# EAGLE design MCP9808  (EAGLE 9.6.2)
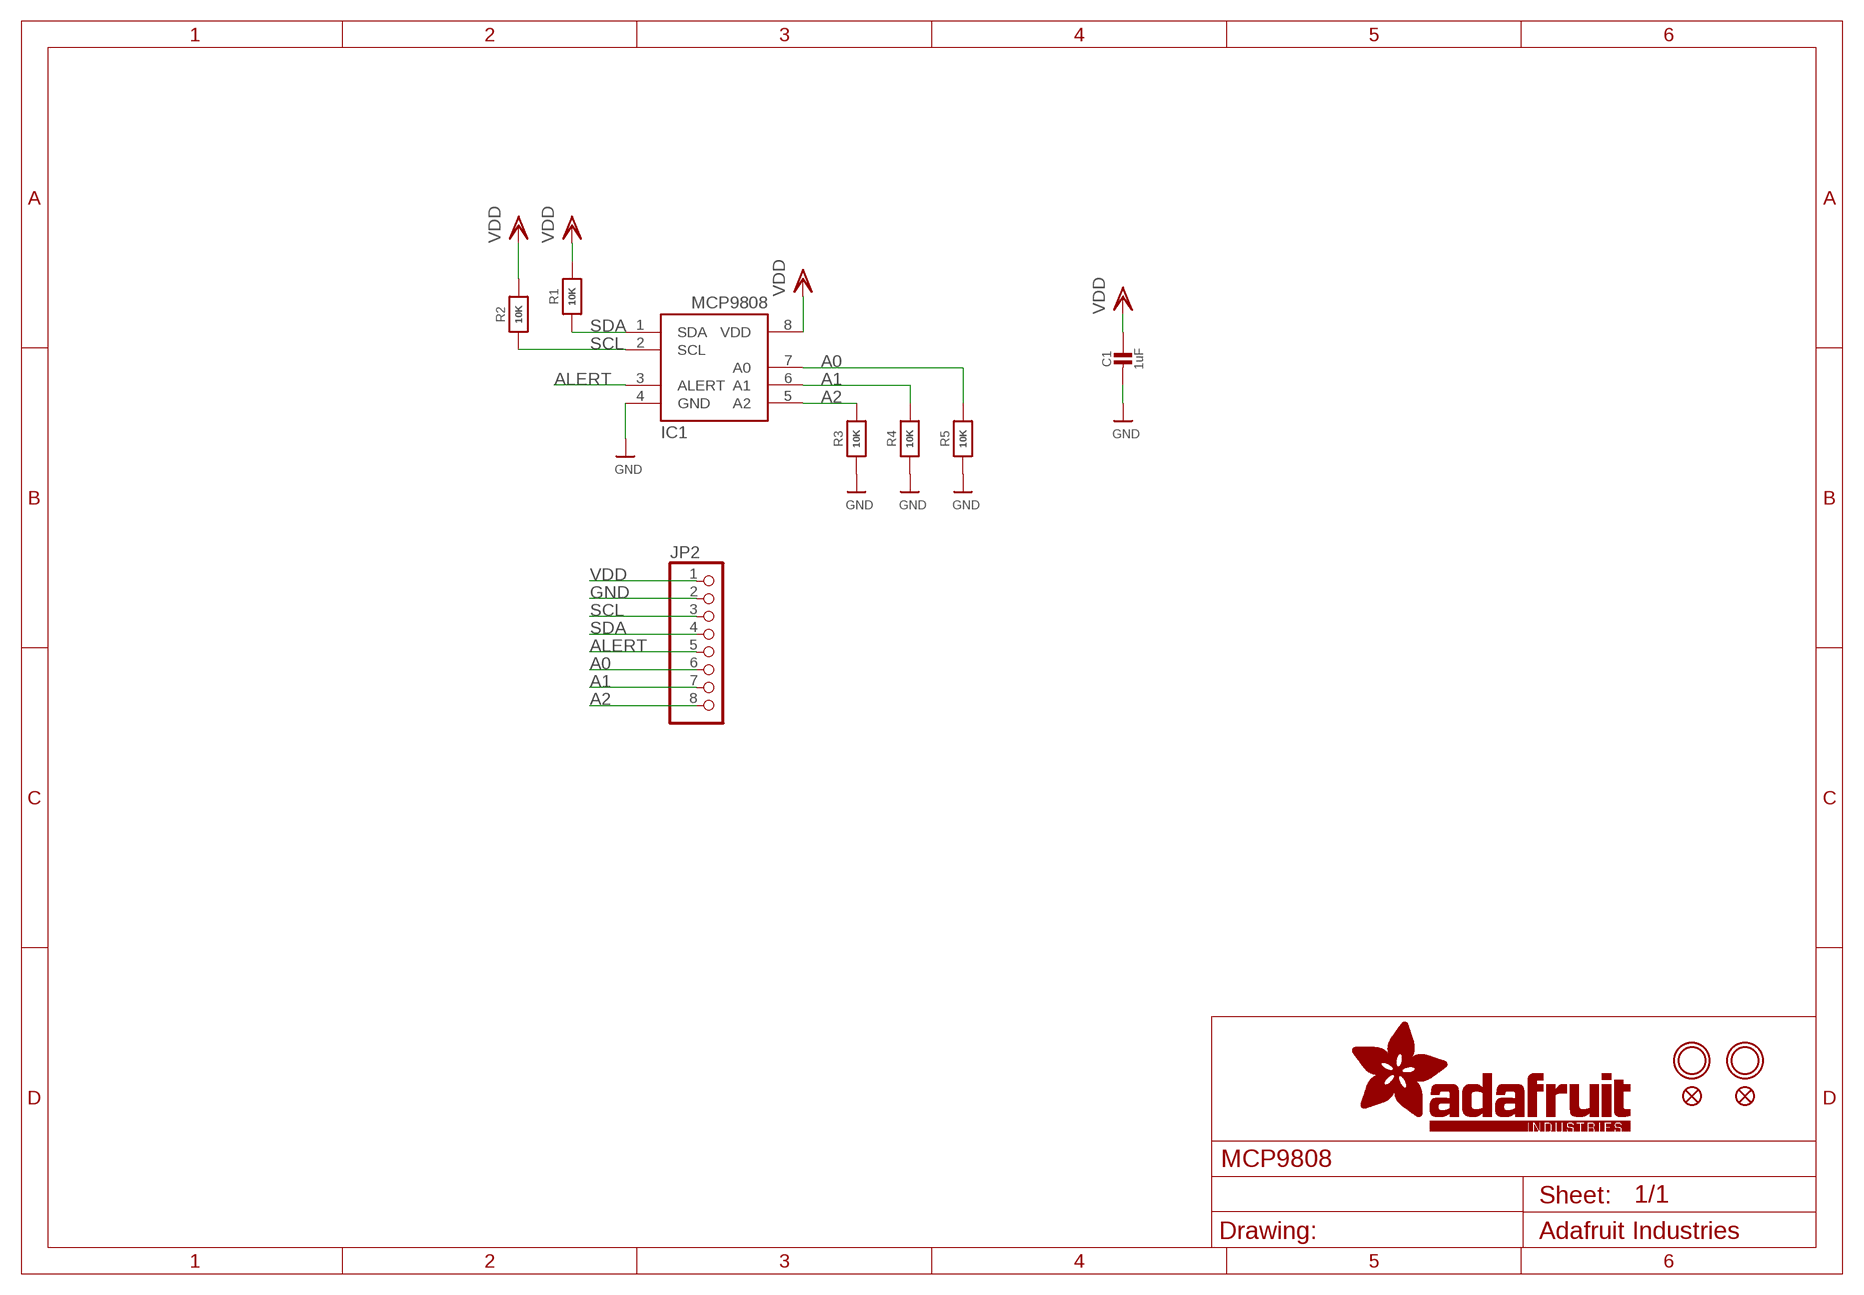
[diagram p0: schematic, sheet 1]

## Parts
C1  1uF  CAP_CERAMIC_0805MP  [_0805MP]
FID1  FIDUCIAL""  [FIDUCIAL_1MM]
FID2  FIDUCIAL""  [FIDUCIAL_1MM]
IC1  MCP9808-E/MS  [MSOP8_0.65MM]
JP2  HEADER-1X870MIL  [1X08_ROUND_70]
R1  10K  RESISTOR0805_NOOUTLINE  [0805-NO]
R2  10K  RESISTOR0805_NOOUTLINE  [0805-NO]
R3  10K  RESISTOR0805_NOOUTLINE  [0805-NO]
R4  10K  RESISTOR0805_NOOUTLINE  [0805-NO]
R5  10K  RESISTOR0805_NOOUTLINE  [0805-NO]
U$3  MOUNTINGHOLE2.5  [MOUNTINGHOLE_2.5_PLATED]
U$5  MOUNTINGHOLE2.5  [MOUNTINGHOLE_2.5_PLATED]

## Nets
A0: IC1.7(A0) JP2.6 R5.2
A1: IC1.6(A1) JP2.7 R4.2
A2: IC1.5(A2) JP2.8 R3.2
ALERT: IC1.3(ALERT) JP2.5
GND: C1.2 IC1.4(GND) JP2.2 R3.1 R4.1 R5.1
SCL: IC1.2(SCL) JP2.3 R2.1
SDA: IC1.1(SDA) JP2.4 R1.1
VDD: C1.1 IC1.8(VDD) JP2.1 R1.2 R2.2

## Library data of the parts
C1 = microbuilder:CAP_CERAMIC: Ceramic Capacitors For new designs, use the packages preceded by an '_' character since they are more reliable: The following footprints should be used on most boards: _0402 - Standard footprint for regular board layouts _0603 - Standard footprint for regular board layouts _0805 - Standard footprint for regular board layouts _1206 - Standard footprint for regular board layouts For extremely tight-pitch boards where space is at a premium, the following 'micro-pitch' footprints can be used (smaller pads, no silkscreen outline, etc.): _0402MP - Micro-pitch footprint for very dense/compact boards _0603MP - Micro-pitch footprint for very dense/compact boards _0805MP - Micro-pitch footprint for very dense/compact boards _1206MP - Micro-pitch footprint for very dense/compact boards
FID1 FID2 = microbuilder:FIDUCIAL: Fiducial Alignment Points Various fiducial points for machine vision alignment.; BOM: EXCLUDE
IC1 = microbuilder:MCP9808
JP2 = microbuilder:HEADER-1X8: PIN HEADER
R1-R5 = microbuilder:RESISTOR: Resistors For new designs, use the packages preceded by an '_' character since they are more reliable: The following footprints should be used on most boards: _0402 - Standard footprint for regular board layouts _0603 - Standard footprint for regular board layouts _0805 - Standard footprint for regular board layouts _1206 - Standard footprint for regular board layouts For extremely tight-pitch boards where space is at a premium, the following 'micro-pitch' footprints can be used (smaller pads, no silkscreen outline, etc.): _0402MP - Micro-pitch footprint for very dense/compact boards _0603MP - Micro-pitch footprint for very dense/compact boards _0805MP - Micro-pitch footprint for very dense/compact boards _1206MP - Micro-pitch footprint for very dense/compact boards
U$3 U$5 = microbuilder:MOUNTINGHOLE: Mounting Hole For #2 screws (0.086"/2.18mm width, 0.094"/2.4mm hole) use 2.5mm; BOM: EXCLUDE

## Board
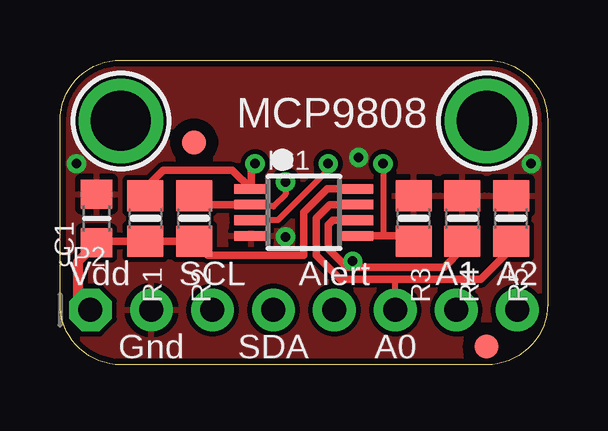
[diagram p1: board, top side]
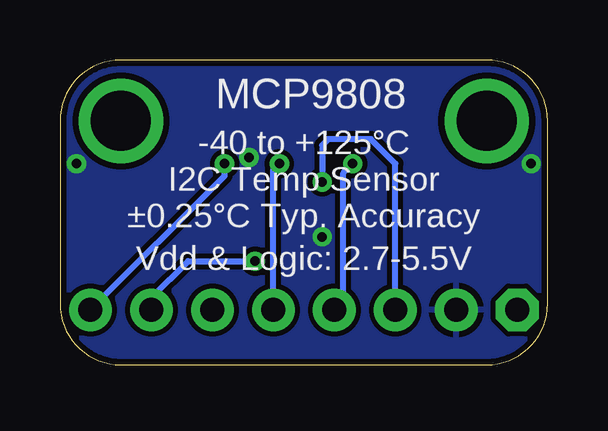
[diagram p2: board, bottom side, seen from below]

Size 20.32 x 12.7 mm. Coordinates in mm from the lower left corner, seen from the top.
Outline: 20.32,10.16 20.32,2.54 arc-90 17.78,0 2.54,0 arc-90 0,2.54 0,10.16 arc-90 2.54,12.7 17.78,12.7 arc-90 20.32,10.16
Copper layers (1*16): Top 0.035mm / dielectric 1.5mm / Bottom 0.035mm
Design rules "adafruit": minimum track width 8mil, minimum drill 15.5mil, track to track 8mil, track to pad 8mil, pad to pad 8mil, via to via 8mil, smd to smd 8mil, copper to edge 10mil, drill to drill 8mil, minimum pad ring 10mil, minimum via ring 8mil, stop-mask expansion 2mil, vias tented up to drill 20mil, thermal gap 10mil

### Footprints (pad centres in the part's own frame; a part is rotated, then mirrored left to right if it is on the bottom)
_0805MP = smd 1.2 x 1.3: 1 -1.016,0; 2 1.016,0
FIDUCIAL_1MM = smd 1 x 1: 1 0,0
MSOP8_0.65MM = smd 0.4 x 1.4: 1 -0.975,-2.2; 2 -0.325,-2.2; 3 0.325,-2.2; 4 0.975,-2.2; 5 0.975,2.2; 6 0.325,2.2; 7 -0.325,2.2; 8 -0.975,2.2
1X08_ROUND_70 = drill 1 pad 1.778 octagon: 1 -8.89,0 | drill 1 pad 1.778: 2 -6.35,0; 3 -3.81,0; 4 -1.27,0; 5 1.27,0; 6 3.81,0; 7 6.35,0; 8 8.89,0
0805-NO = smd 1.3 x 1.5: 1 -0.95,0; 2 0.95,0
MOUNTINGHOLE_2.5_PLATED = drill 2.5 pad 3.2: P$1 0,0

### Placement (x,y rotation side)
C1  1.52,6.1 90 top
FID1  5.59,9.27 0 top
FID2  17.78,0.76 0 top
IC1  10.16,6.35 270 top
JP2  10.16,2.29 0 top
R1  3.56,6.1 270 top
R2  5.59,6.1 270 top
R3  14.73,6.1 270 top
R4  16.76,6.1 270 top
R5  18.8,6.1 270 top
U$3  2.54,10.16 0 top
U$5  17.78,10.16 0 top

### Tracks (layer width: path | path; a pad name or v marks a point on that pad's centre or on a via)
A0
  Top 0.254: JP2.6 13.97,3.56
  Top 0.305: R5.2 18.8,4.83 17.53,3.56 13.97,3.56 11.68,3.56 10.67,4.57 10.67,6.1 11.25,6.67 IC1.7
A1  (via drill 0.39)
  Top 0.305: R4.2 16.76,4.83 16,4.06 12.32,4.06 | 12.32,4.06 11.94,4.06 11.18,4.83 11.18,5.84 11.36,6.03 IC1.6 | v12.19,4.32 12.32,4.19 12.32,4.06
  Bottom 0.254: JP2.7 16.51,2.79 14.99,4.32 v12.19,4.32
A2  (via drill 0.39)
  Top 0.254: v13.46,8.38 13.46,5.38
  Top 0.305: IC1.5 13.46,5.38 14.5,5.38 R3.2
  Bottom 0.254: JP2.8 13.46,7.87 v13.46,8.38
ALERT  (via drill 0.39)
  Top 0.254: v11.18,8.38 11.18,8.13 9.07,6.03 IC1.3
  Bottom 0.254: JP2.5 11.43,8.13 v11.18,8.38
GND  (via drill 0.39)
  other vias: 9.4,5.33 12.45,8.64 0.69,8.38 19.63,8.38
  pour Top: 0,12.7 0,0 20.32,0 20.32,12.7
  pour Bottom: 0,12.7 0,0 20.32,0 20.32,12.7
SCL  (via drill 0.39)
  Top 0.254: v9.4,7.62 9.4,7.11 8.89,6.6 8.03,6.6 IC1.2
  Top 0.305: IC1.2 5.96,6.67 R2.1
  Bottom 0.254: JP2.3 6.35,8.38 7.37,9.4 9.14,9.4 9.4,9.14 v9.4,7.62
SDA  (via drill 0.39)
  Top 0.254: IC1.1 7.96,7.45
  Top 0.305: 7.96,7.45 7.96,8.21 v8.13,8.38 | R1.1 3.56,7.37 4.29,8.1 7.18,8.1 IC1.1
  Bottom 0.254: JP2.4 8.51,2.67 8.51,8 v8.13,8.38
VDD
  Top 0.305: C1.1 1.59,5.15 R1.2 R2.2 6.16,4.57 10.16,4.57 10.16,6.35 11.13,7.33 IC1.8
  Top 0.406: 1.27,4.83 C1.1 0.76,4.32 0.76,2.79 JP2.1

### Text on the board
Unrouted: MCP9808 SICAKLIK SENSOR
tPlace: MCP9808 | Vdd | SCL | Alert | A1 | A2 | Gnd | SDA | A0
bPlace: MCP9808 | -40 to +125°C | I2C Temp Sensor | ±0.25°C Typ. Accuracy | Vdd & Logic: 2.7-5.5V